# Altium project IOT_GRN_POWER V1.0 A.PrjPcb
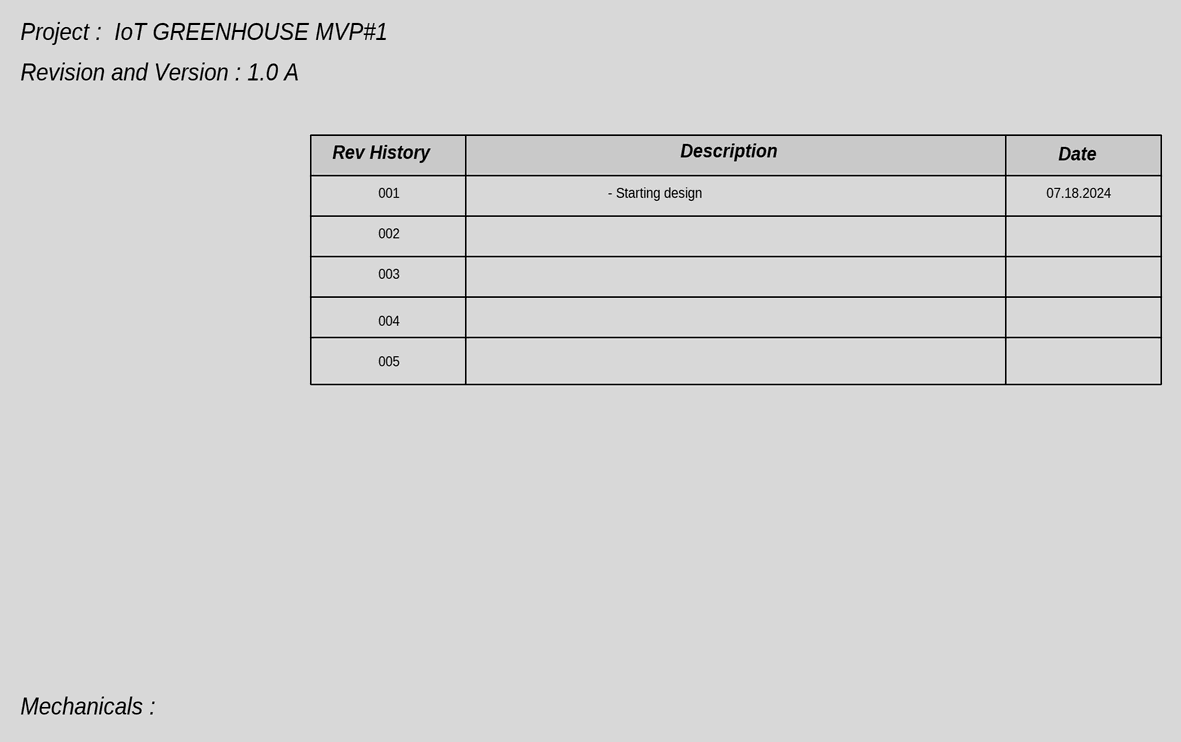
[diagram p0: IOT_GRN_POWER V1.0 A - Rev His.SchDoc]
Letter: A; ProjectTitle: IOT_GRN_POWER V1.0 A; Version: 1.0
2 sheets, 9 parts. Net scope: global (net labels, ports and power ports of the same name join across sheets).
Board file: IOT_GRN_POWER V1.0 A.PcbDoc
Sheets:
  IOT_GRN_POWER V1.0 A - Rev His.SchDoc
  IOT_GRN_POWER V1.0 A - MAIN.SchDoc

## Sheet IOT_GRN_POWER V1.0 A - Rev His.SchDoc
size A4; Email: eliofagundez07@gmail.com; DrawnBy: ELIO F.; Engineer: ELIO F.; Revision: A; SheetNumber: 1; SheetTotal: 2; Sheet Title: Cover Page

### Notes on the sheet
- Project :  IoT GREENHOUSE MVP#1
- Revision and Version : 1.0 A
- Rev History
- 001
- - Starting design
- Description
- 07.18.2024
- Date
- 002
- 003
- 004
- 005
- Mechanicals :
- PCB Des :
- Approv By :
- Project Title :
- Sheet Title :
- Date :
- PCB Version :
- Size :
- A4
- Page :
- PCB Revision :

## Sheet IOT_GRN_POWER V1.0 A - MAIN.SchDoc
size A4; SheetNumber: 2; SheetTotal: 2
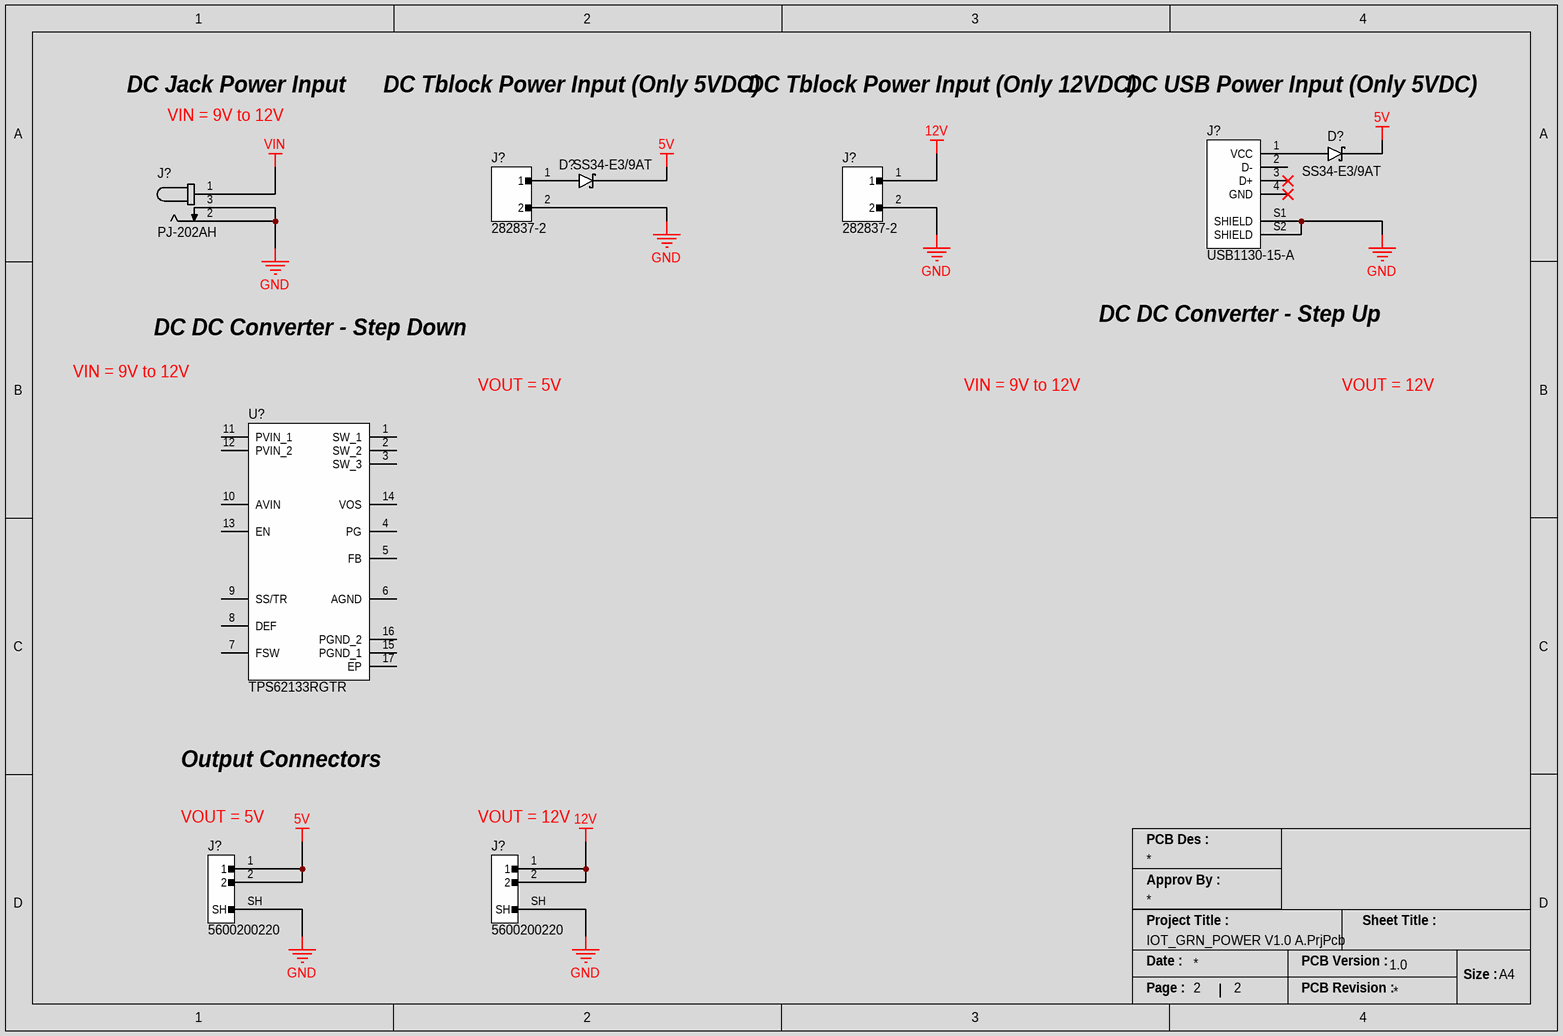
[diagram p1: IOT_GRN_POWER V1.0 A - MAIN.SchDoc]

### Parts
(Parts that share a designator on the sheet are numbered #1, #2 ... from top to bottom, then left to right.)
D?#1  SS34-E3/9AT  [DIO_Vishay_SMC_MFG]
D?#2  SS34-E3/9AT  [DIO_Vishay_SMC_MFG]
J?#1  PJ-202AH  [CONN_CUI_PJ-202AH]
J?#2  282837-2  [CONN_TBLOCK_2P_\2828372]
J?#3  282837-2  [CONN_TBLOCK_2P_\2828372]
J?#4  USB1130-15-A  [CONN_USBA_GCT_USB1130-15-A_REVA]
J?#5  5600200220  [CONN_2P_DURACLICK_5600200220]
J?#6  5600200220  [CONN_2P_DURACLICK_5600200220]
U?  TPS62133RGTR  [IC_REG_QFN50P300X300X100-17N-D]

### Nets
5V: D?#1.1(K) D?#2.1(K) J?#5.1 J?#5.2
12V: J?#3.1 J?#6.1 J?#6.2
GND: J?#1.2 J?#1.3 J?#2.2 J?#3.2 J?#4.S1(SHIELD) J?#4.S2(SHIELD) J?#5.SH J?#6.SH
VIN: J?#1.1
NetD?#1_2: D?#1.2(A) J?#4.1(VCC)
NetD?#2_2: D?#2.2(A) J?#2.1

Not connected (* = marked no-connect by the designer): J?#4 2(D-) 3(D+)* 4(GND)*; U? 1(SW_1) 2(SW_2) 3(SW_3) 4(PG) 5(FB) 6(AGND) 7(FSW) 8(DEF) 9(SS/TR) 10(AVIN) 11(PVIN_1) 12(PVIN_2) 13(EN) 14(VOS) 15(PGND_1) 16(PGND_2) 17(EP)

### Notes on the sheet
- DC Jack Power Input
- DC Tblock Power Input (Only 5VDC)
- DC Tblock Power Input (Only 12VDC)
- DC USB Power Input (Only 5VDC)
- VIN = 9V to 12V
- DC DC Converter - Step Down
- DC DC Converter - Step Up
- VOUT = 5V
- VOUT = 12V
- Output Connectors
- (near J?#5) VOUT = 5V
- (near J?#6) VOUT = 12V
- PCB Des :
- Approv By :
- Project Title :
- Sheet Title :
- Date :
- PCB Version :
- Size :
- A4
- Page :
- PCB Revision :

### Library data of the parts
D?#1 D?#2 = DIO_SCTKY_40V_3A: Rectifier Diode, schottky, 40V V(Rrm), do-214Ab / Smc; Manufacturer: Vishay Semiconductors; Max Surge Current: 100A; Element Configuration: Single; Max Reverse Leakage Current: 500uA; Average Rectified Current: 3A; Forward Voltage: 500mV; Supplier 1: TTI; Manufacturer Part Number: SS34-E3/9AT; RoHS: Yes; Category: Rectifier Diodes; Stock 1: 7000; Pricing 1: 3500=0.18200 (USD); Mount: Surface Mount; Case/Package: SMC; Number of Pins: 2; Min Operating Temperature: -55°C; Max Operating Temperature: 125°C; Package Quantity: 3500; Packaging: Tape and Reel; Peak Non-Repetitive Surge Current: 100A; Max Reverse Voltage (DC): 40V; Series: -; Radiation Hardening: No; RoHS Compliant: Yes; ComponentLink1URL: https://datasheet.ciiva.com/920/ss32-920172.pdf?src-supplier=Digi-Key; ComponentLink1Description: https://datasheet.ciiva.com/920/ss32-920172.pdf?src-supplier=Digi-Key; Supplier Part Number 1: SS34-E3/9AT; Max Reverse Current: 500uA; Max Repetitive Reverse Voltage (Vrrm): 40V; Forward Current: 3A
J?#1 = CONN_DC_JACK_2X6.5mm_PJ-202AH: 2.0 x 6.5 mm, 5.0 A, Horizontal, Through Hole, Kinked Pins, Dc Power Jack Connector; Manufacturer: CUI Devices; Body Color: Black; Shielding: Unshielded; Gender: Male; Supplier 1: Digi-Key; Manufacturer Part Number: PJ-202AH; RoHS: Yes; Category: Power Connectors; Stock 1: 143167; Pricing 1: 1=0.78, 25=0.6528, 100=0.5988, 500=0.48902, 2500=0.40274, 10000=0.36162 (USD); Mount: Through Hole; Contact Plating: Silver; Contact Material: Brass; Housing Material: PBT; Min Operating Temperature: -25°C; Max Operating Temperature: 85°C; Connector Type: Jack; Termination: Kinked Pin; Series: -; Flammability Rating: UL94 V-0; ComponentLink1URL: https://datasheet.octopart.com/PJ-202AH-CUI-Devices-datasheet-137760703.pdf?src-supplier=Future+Electronics; ComponentLink1Description: https://datasheet.octopart.com/PJ-202AH-CUI-Devices-datasheet-137760703.pdf?src-supplier=Future+Electronics; ComponentLink2URL: https://datasheet.octopart.com/PJ-202AH-CUI-datasheet-54017.pdf?src-supplier=Digi-Key; ComponentLink2Description: https://datasheet.octopart.com/PJ-202AH-CUI-datasheet-54017.pdf?src-supplier=Digi-Key; ComponentLink3URL: https://datasheet.octopart.com/PJ-202AH-CUI-Devices-datasheet-141002001.pdf?src-supplier=Electro+Sonic; ComponentLink3Description: https://datasheet.octopart.com/PJ-202AH-CUI-Devices-datasheet-141002001.pdf?src-supplier=Electro+Sonic; Supplier Part Number 1: CP-202AH-ND
J?#2 J?#3 = CONN_TBLOCK_2P_5.08mm_282837-2: Connector, Terminal Block; Wire Receptacle; 2 Pos.; 16-30 AWG; 0.2 in. CL; Side;; Manufacturer: TE Connectivity; Plating: Brass; Number of Levels: 1; Number of Positions Per Level: 2; Current: 13.5A; Voltage: 300V; Closed End: No (Without); Interlock: Yes (With); Voltage Rating: 250V; Connector System: Wire-to-Board; Wire Gauge (Max): 28AWG; Wire Gauge (Min): 30AWG; Pitch: 5.08mm; Thread Size: M3; Tail Length: 3.5mm; Supplier 1: Digikey; Manufacturer Part Number: 282837-2; RoHS: Yes; Category: Terminal Blocks; Stock 1: 217371; Pricing 1: 1=0.7, 10=0.681, 25=0.678, 50=0.6552, 100=0.5494, 250=0.51504, 500=0.48644, 1000=0.42635, 5000=0.37199 (USD); Mount: Through Hole; Contact Material: Brass; Contact Plating: Tin; Color: Green; Housing Color: Green; Housing Material: Polyamide; Weight: 0.059966oz; Min Operating Temperature: -40°C; Max Operating Temperature: 110°C; Number of Rows: 1; Packaging: Tray; Package Quantity: 300; Termination: Screw; Number of Positions: 2; Series: Buchanan; Current Rating: 13.5A; Screw Flange: No (Without); Screwless Terminal Block: No (Without); Side Stackable: Yes (With); Max Current Rating: 13.5A; Connector Type: Receptacle; Voltage Rating (AC): 250V; Operating Supply Voltage: 300V; Flammability Rating: UL94 V-0; RoHS Compliant: Yes; ELV: Compliant; Lead Free: Lead Free; Reach SVHC Compliant: Unknown; ComponentLink1URL: https://datasheet.ciiva.com/819/eng-cs-1308389-eurostyle-terminal-blocks-0607-819104.pdf?src-supplier=Avnet; ComponentLink1Description: https://datasheet.ciiva.com/819/eng-cs-1308389-eurostyle-terminal-blocks-0607-819104.pdf?src-supplier=Avnet; ComponentLink2URL: https://datasheet.ciiva.com/11758/0900766b80e7dc97-11758677.pdf?src-supplier=Rs; ComponentLink2Description: https://datasheet.ciiva.com/11758/0900766b80e7dc97-11758677.pdf?src-supplier=Rs; ComponentLink3URL: https://datasheet.ciiva.com/16305/eng-cs-1308389-eurostyle-terminal-blocks-0607-16305248.pdf?src-supplier=Future+Electronics; ComponentLink3Description: https://datasheet.ciiva.com/16305/eng-cs-1308389-eurostyle-terminal-blocks-0607-16305248.pdf?src-supplier=Future+Electronics; ComponentLink4URL: https://datasheet.ciiva.com/19467/750688-19467564.pdf?src-supplier=Jameco; ComponentLink4Description: https://datasheet.ciiva.com/19467/750688-19467564.pdf?src-supplier=Jameco; ComponentLink5URL: https://datasheet.ciiva.com/18620/eng-cd-282837-g3-18620917.pdf?src-supplier=Digikey; ComponentLink5Description: https://datasheet.ciiva.com/18620/eng-cd-282837-g3-18620917.pdf?src-supplier=Digikey; ComponentLink6URL: https://datasheet.ciiva.com/823/eng-cd-282837-g3-823439.pdf?src-supplier=Digikey; ComponentLink6Description: https://datasheet.ciiva.com/823/eng-cd-282837-g3-823439.pdf?src-supplier=Digikey; ComponentLink7URL: https://datasheet.ciiva.com/7978/1650926-7978569.pdf?src-supplier=Element14; ComponentLink7Description: https://datasheet.ciiva.com/7978/1650926-7978569.pdf?src-supplier=Element14; ComponentLink8URL: https://datasheet.ciiva.com/14606/70086281-14606908.pdf?src-supplier=Allied+Electronics; ComponentLink8Description: https://datasheet.ciiva.com/14606/70086281-14606908.pdf?src-supplier=Allied+Electronics; ComponentLink9URL: https://datasheet.ciiva.com/30084/eng-cs-1308389-eurostyle-terminal-blocks-0607-30084269.pdf?src-supplier=Onlinecomponents.com; ComponentLink9Description: https://datasheet.ciiva.com/30084/eng-cs-1308389-eurostyle-terminal-blocks-0607-30084269.pdf?src-supplier=Onlinecomponents.com; Supplier Part Number 1: A113320-ND
J?#4 = CONN_USB_TYPEA_USB1130-15-A: Usb Conn, 2.0 Type A, R/a Rcpt, 4Pos, Th Rohs Compliant: Yes; Manufacturer: Global Connector Technology; Supplier 1: Verical; Manufacturer Part Number: USB1130-15-A; RoHS: No; Category: Connectors; Stock 1: 439; Pricing 1: 168=0.4883, 250=0.4687 (USD); ComponentLink1URL: https://datasheet.octopart.com/USB1130-15-A-Global-Connector-Technology-datasheet-148834151.pdf?src-supplier=Future+Electronics; ComponentLink1Description: https://datasheet.octopart.com/USB1130-15-A-Global-Connector-Technology-datasheet-148834151.pdf?src-supplier=Future+Electronics; Supplier Part Number 1: USB1130-15-A
J?#5 J?#6 = CONN_2P_DURACLICK_5600200220: DuraClik Wire-to-Board Header, Single Row, Vertical, 2 Circuits, Tin (Sn) Over Nickel, Natural; Manufacturer: Molex; Number of Circuits: 2; Gender: Male; Current Rating: 3A; Voltage Rating: 125V; Pitch: 2mm; Glow Wire Compliant: Non-compliant; Supplier 1: Digikey; Manufacturer Part Number: 5600200220; RoHS: Yes; Category: Headers and Wire Housings; Stock 1: 66363; Pricing 1: 1=0.62, 10=0.514, 100=0.4284 (USD); Contact Plating: Tin; Contact Material: Copper Alloy; Min Operating Temperature: -40°C; Max Operating Temperature: 125°C; Number of Rows: 1; Termination: Solder; Number of Contacts: 2; Orientation: Vertical; Height: 8.2mm; Reach SVHC Compliant: Unknown; Supplier Part Number 1: WM10862CT-ND
U? = IC_REG_BUCK_5V_3A_TPS62133RGTR: Conv DC-DC 3V to 17V Synchronous Step Down Single-Out 5V 3A 16-Pin VQFN EP T/R; Manufacturer: Texas Instruments; Number of Outputs: 1; Switching Frequency: 2.5MHz; Synchronous Rectifier: Yes; Quiescent Current: 17uA; Output Type: Fixed; Output Configuration: Positive; Supplier 1: Digikey; Manufacturer Part Number: TPS62133RGTR; RoHS: Yes; Category: Voltage Regulators - Switching; Stock 1: 4558; Pricing 1: 1=1.83, 10=1.646, 25=1.5528, 100=1.323, 250=1.24232, 500=1.08702, 1000=0.90067, 3000=0.83855, 6000=0.8075 (USD); Case/Package: QFN; Number of Pins: 16; Min Operating Temperature: -40°C; Max Operating Temperature: 125°C; Output Voltage: 5V; Output Current: 3A; Packaging: Tape and Reel; Package Quantity: 1; Max Output Current: 3A; Max Input Voltage: 17V; Min Input Voltage: 3V; Min Output Voltage: 5V; Max Output Voltage: 5V; Operating Supply Voltage: 17V; Series: DCS-Control™; Length: 3mm; Width: 3mm; Height: 1mm; Thickness: 900um; Lead Free: Lead Free; RoHS Compliant: Yes; ComponentLink1URL: https://datasheet.ciiva.com/2026/tps62131-2026576.pdf?src-supplier=Digikey; ComponentLink1Description: https://datasheet.ciiva.com/2026/tps62131-2026576.pdf?src-supplier=Digikey; ComponentLink2URL: https://datasheet.ciiva.com/2035/tps62130-2035262.pdf?src-supplier=Digikey; ComponentLink2Description: https://datasheet.ciiva.com/2035/tps62130-2035262.pdf?src-supplier=Digikey; ComponentLink3URL: https://datasheet.ciiva.com/2035/tps62130-2035263.pdf?src-supplier=Digikey; ComponentLink3Description: https://datasheet.ciiva.com/2035/tps62130-2035263.pdf?src-supplier=Digikey; Supplier Part Number 1: 296-29937-1-ND

## Assembly variants
Base Variant: not fitted C64 C70 C104 C108 C113 C123 C125 R8 R22 R23 R27 R28 R31 R32 R33 R34 R40 R50